# EAGLE design controller-HAT (EAGLE 9.2.2)
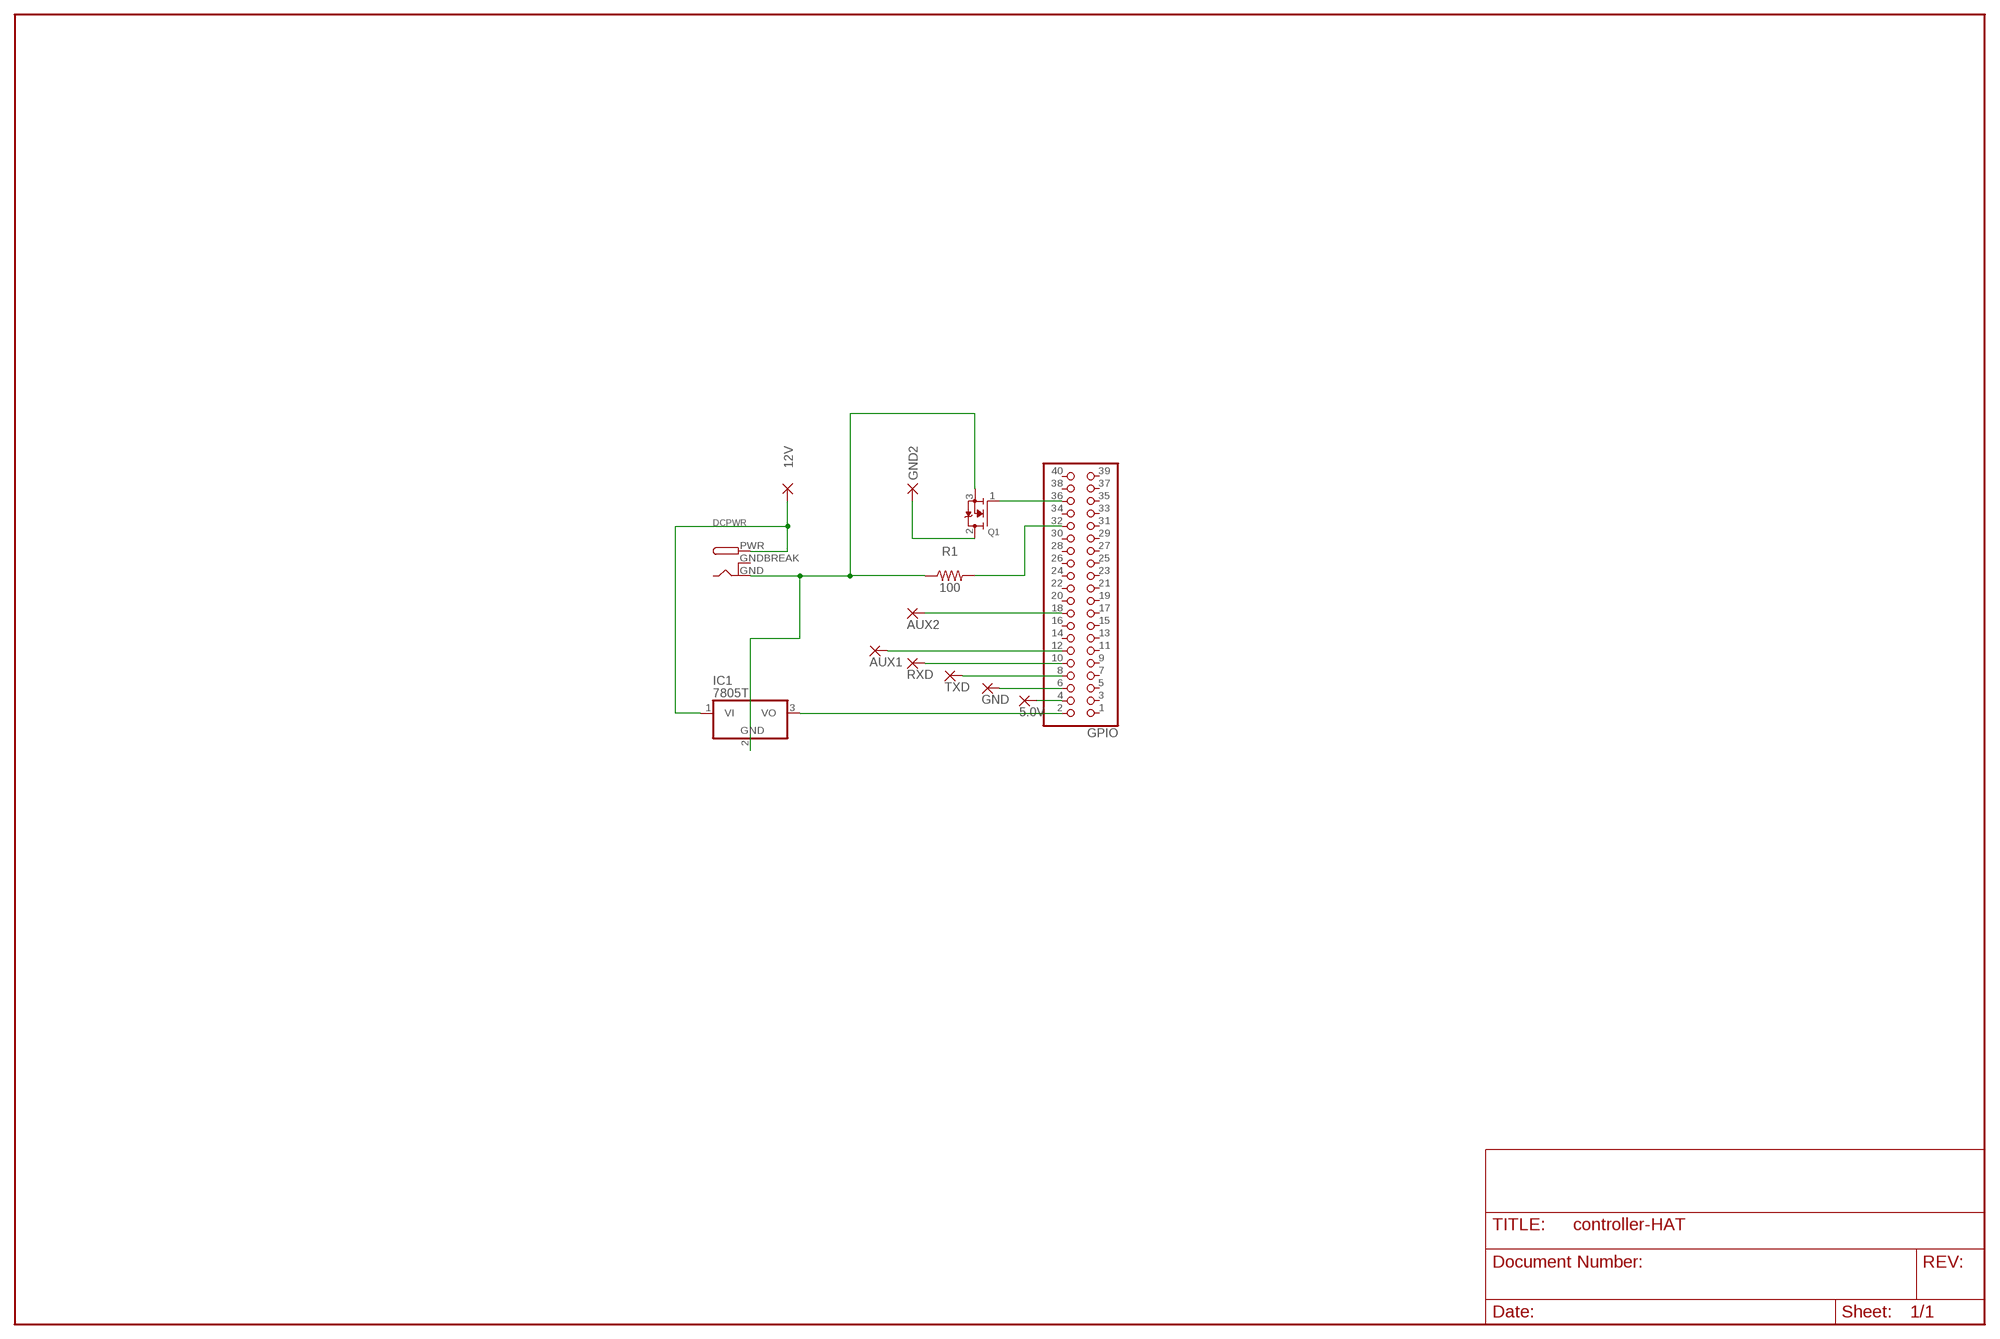
[diagram p0: schematic, sheet 1]

## Parts
5.0V  1,6/0,9  [1,6/0,9]
12V  1,6/0,9  [1,6/0,9]
AUX1  1,6/0,9  [1,6/0,9]
AUX2  1,6/0,9  [1,6/0,9]
DCPWR  DCBARRELPTH  [DCJACK_2MM_PTH]
GND  1,6/0,9  [1,6/0,9]
GND2  1,6/0,9  [1,6/0,9]
GPIO  PINHD-2X20  [2X20]
IC1  7805T  [TO220H]
Q1  MOSFET-NGDS_TO220V  [TO220V]
R1  100  100OHM-HORIZ-1/4W-1%  [AXIAL-0.3]
RXD  1,6/0,9  [1,6/0,9]
TXD  1,6/0,9  [1,6/0,9]

## Nets
N$1: GND2.1(P) Q1.2(D)
N$2: 12V.1(P) DCPWR.PWR IC1.1(VI)
N$3: GPIO.32 R1.P$2
N$4: DCPWR.GND IC1.2(GND) Q1.3(S) R1.P$1
N$5: GPIO.36 Q1.1(G)
N$6: 5.0V.1(P) GPIO.4
N$7: GND.1(P) GPIO.6
N$8: GPIO.8 TXD.1(P)
N$9: GPIO.10 RXD.1(P)
N$10: AUX1.1(P) GPIO.12
N$11: AUX2.1(P) GPIO.18
N$12: GPIO.2 IC1.3(VO)
Unconnected: GPIO.1 GPIO.3 GPIO.5 GPIO.7 GPIO.9 GPIO.11 GPIO.13 GPIO.14 GPIO.15 GPIO.16 GPIO.17 GPIO.19 GPIO.20 GPIO.21 GPIO.22 GPIO.23 GPIO.24 GPIO.25 GPIO.26 GPIO.27 GPIO.28 GPIO.29 GPIO.30 GPIO.31 GPIO.33 GPIO.34 GPIO.35 GPIO.37 GPIO.38 GPIO.39 GPIO.40

## Power pins joined to a net without a drawn wire
GNDBREAK: DCPWR.GNDBREAK

## Library data of the parts
5.0V = wirepad:1,6/0,9: THROUGH-HOLE PAD; SPICEPREFIX: X
12V AUX1 AUX2 GND GND2 RXD TXD = wirepad:1,6/0,9: THROUGH-HOLE PAD
DCPWR = adafruit:DCBARREL: 2.0mm DC Barrel Jack DCJACK_2MM_PTH - Through Hole Jack (4UConnector: 05537)
GPIO = adafruit:PINHD-2X20: PIN HEADER
IC1 = adafruit:78*: Positive VOLTAGE REGULATOR Added bigger pads to the TO-92 package
Q1 = adafruit:MOSFET-N: N-Channel Mosfet 2N7002E - 60V 260mA SOT23 [Digikey: 2N7002ET1GOSTR-ND] - REEL BSH103 - 30V 850mA SOT23 [Digikey: 568-5013-1-ND]
R1 = SparkFun-Resistors:100OHM: 100Ω resistor A resistor is a passive two-terminal electrical component that implements electrical resistance as a circuit element. Resistors act to reduce current flow, and, at the same time, act to lower voltage levels within circuits. - Wikipedia; PROD_ID: RES-12181

## Board
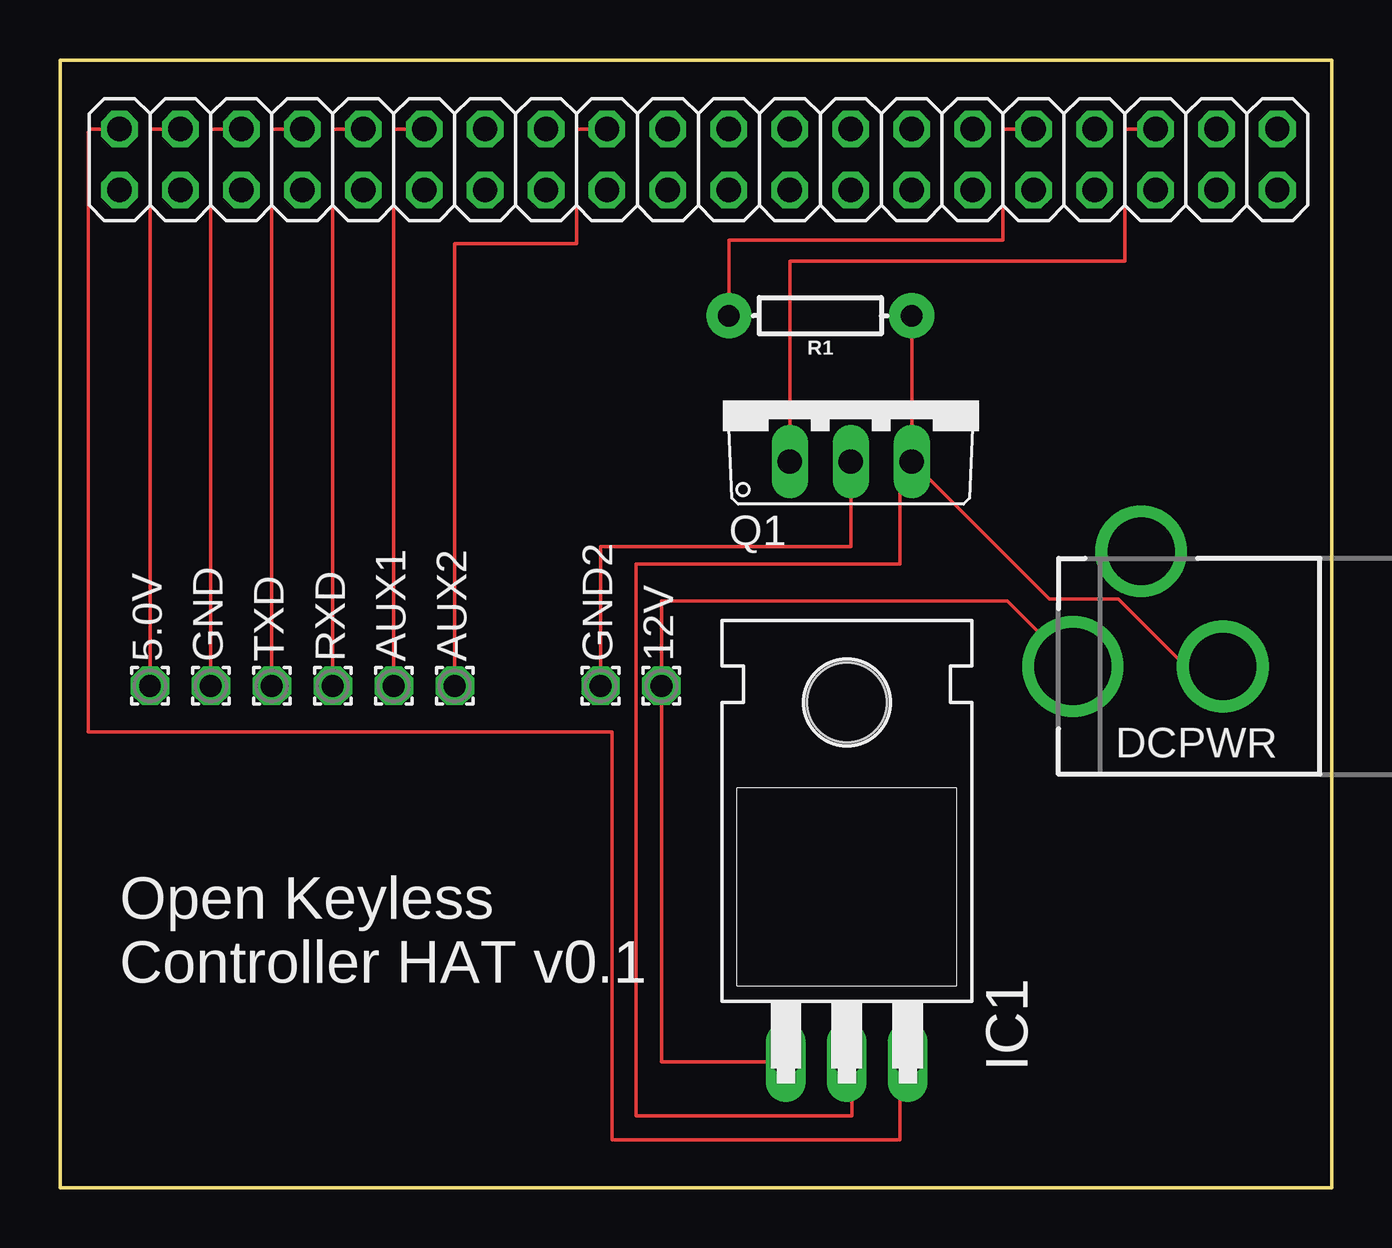
[diagram p1: board, top side]
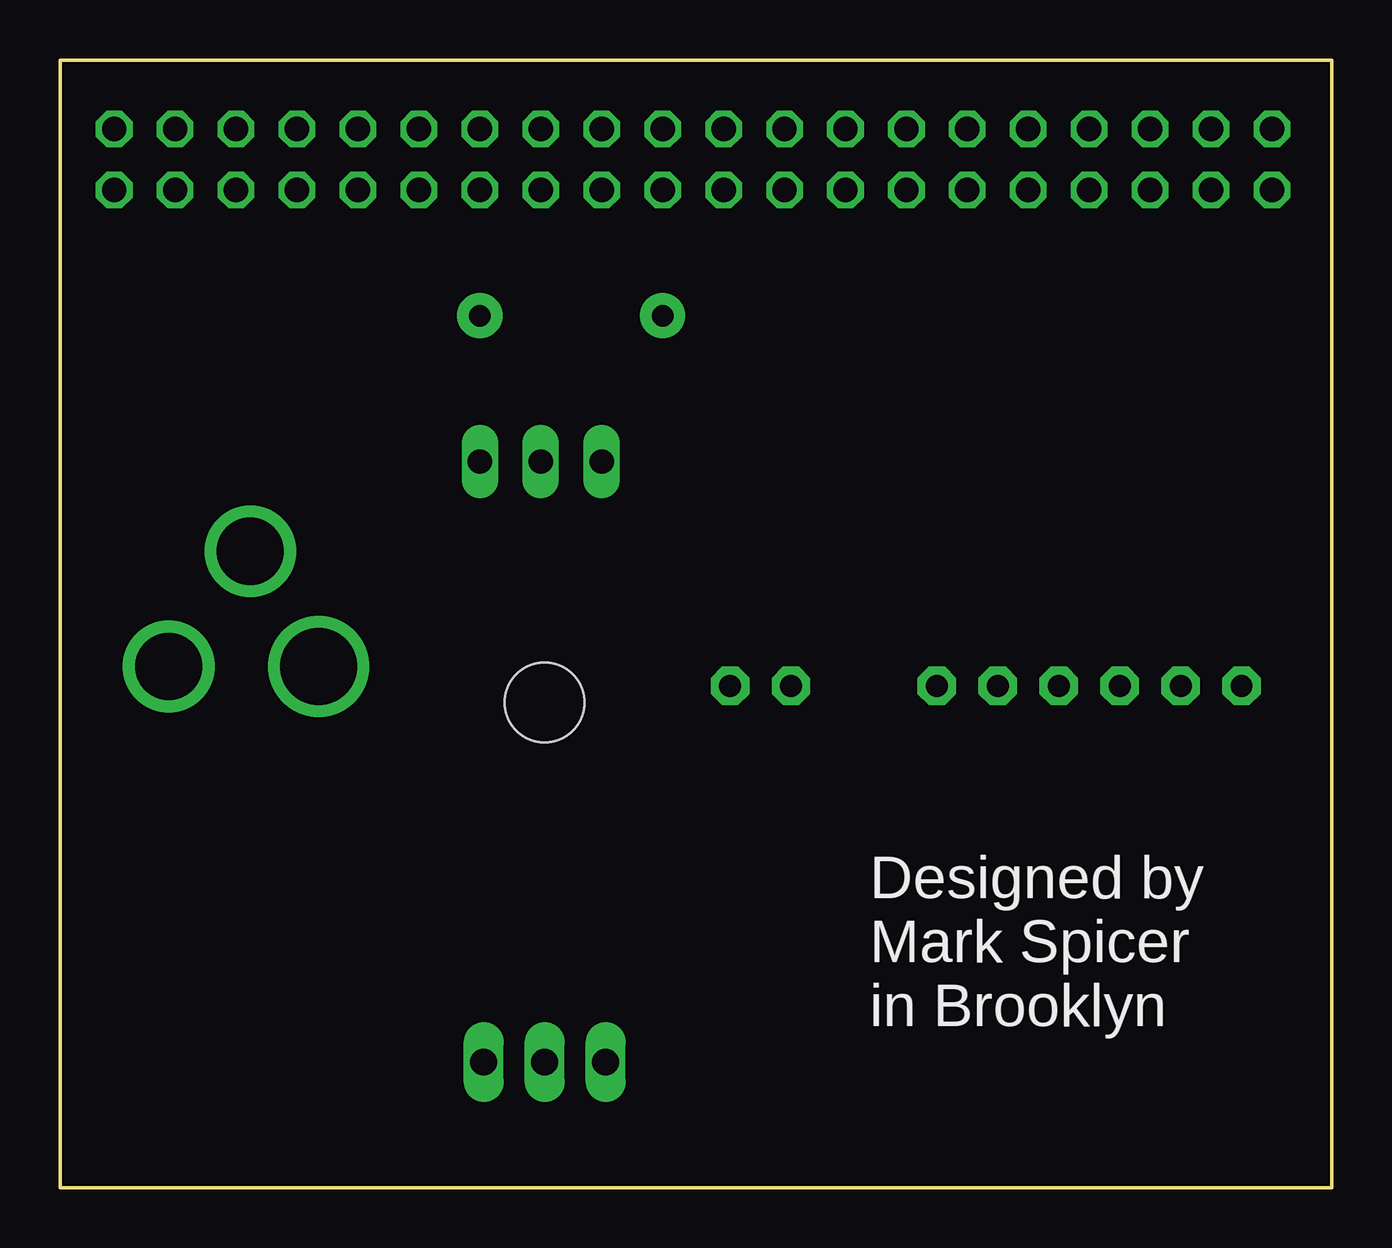
[diagram p2: board, bottom side, seen from below]

Size 53 x 47 mm. Coordinates in mm from the lower left corner, seen from the top.
Outline: 0,47 0,0 53,0 53,47 0,47
Copper layers (1*16): Top 0.035mm / dielectric 1.5mm / Bottom 0.035mm
Design rules "default": minimum track width 6mil, minimum drill 0.35mm, track to track 6mil, track to pad 6mil, pad to pad 6mil, via to via 6mil, smd to smd 6mil, copper to edge 40mil, drill to drill 6mil, minimum pad ring 10mil, minimum via ring 8mil, stop-mask expansion 4mil, vias tented up to drill 0mil, thermal gap 10mil

### Footprints (pad centres in the part's own frame; a part is rotated, then mirrored left to right if it is on the bottom)
1,6/0,9 = drill 0.914 pad 1.6 octagon: 1 0,0
DCJACK_2MM_PTH = drill 2.8: GND 0,7.35; GNDBREAK 4.8,10.75 | drill 3.2: PWR 0,13.6
2X20 = drill 1.016 octagon: 1 -24.13,-1.27; 2 -24.13,1.27; 3 -21.59,-1.27; 4 -21.59,1.27; 5 -19.05,-1.27; 6 -19.05,1.27; 7 -16.51,-1.27; 8 -16.51,1.27; 9 -13.97,-1.27; 10 -13.97,1.27; 11 -11.43,-1.27; 12 -11.43,1.27; 13 -8.89,-1.27; 14 -8.89,1.27; 15 -6.35,-1.27; 16 -6.35,1.27; 17 -3.81,-1.27; 18 -3.81,1.27; 19 -1.27,-1.27; 20 -1.27,1.27; 21 1.27,-1.27; 22 1.27,1.27; 23 3.81,-1.27; 24 3.81,1.27; 25 6.35,-1.27; 26 6.35,1.27; 27 8.89,-1.27; 28 8.89,1.27; 29 11.43,-1.27; 30 11.43,1.27; 31 13.97,-1.27; 32 13.97,1.27; 33 16.51,-1.27; 34 16.51,1.27; 35 19.05,-1.27; 36 19.05,1.27; 37 21.59,-1.27; 38 21.59,1.27; 39 24.13,-1.27; 40 24.13,1.27
TO220H = drill 1.118 long: 1 -2.54,-10.16; 2 0,-10.16; 3 2.54,-10.16 | hole 3.302: 0,4.826
TO220V = drill 1.016 long: 1 -2.54,-2.54; 2 0,-2.54; 3 2.54,-2.54
AXIAL-0.3 = drill 0.9 pad 1.88: P$1 -3.81,0; P$2 3.81,0

### Placement (x,y rotation side)
5.0V  3.75,20.91 0 top
12V  25.07,20.91 0 top
AUX1  13.91,20.91 0 top
AUX2  16.45,20.91 0 top
DCPWR  55.82,21.72 90 top
GND  6.29,20.91 0 top
GND2  22.53,20.91 0 top
GPIO  26.61,42.85 0 top
IC1  32.8,15.39 0 top
Q1  32.96,32.8 0 top
R1  31.69,36.34 180 top
RXD  11.37,20.91 0 top
TXD  8.83,20.91 0 top

### Tracks (layer width: path | path; a pad name or v marks a point on that pad's centre or on a via)
N$1
  Top 0.152: GND2.1 22.53,26.72 32.96,26.72 Q1.2
N$2
  Top 0.152: DCPWR.PWR 39.49,24.45 25.07,24.45 12V.1 25.07,5.23 IC1.1
N$3
  Top 0.152: R1.P$2 27.88,39.5 39.31,39.5 39.31,44.12 GPIO.32
N$4
  Top 0.152: Q1.3 41.23,24.53 44.12,24.53 46.93,21.72 DCPWR.GND | Q1.3 R1.P$1 | Q1.3 35,29.76 35,26 24,26 24,3 33,3 33,5.03 IC1.2
N$5
  Top 0.152: Q1.1 30.42,38.61 44.39,38.61 44.39,44.12 GPIO.36
N$6
  Top 0.152: 5.0V.1 3.75,44.12 GPIO.4
N$7
  Top 0.152: GND.1 6.29,44.12 GPIO.6
N$8
  Top 0.152: TXD.1 8.83,44.12 GPIO.8
N$9
  Top 0.152: RXD.1 11.37,44.12 GPIO.10
N$10
  Top 0.152: AUX1.1 13.91,44.12 GPIO.12
N$11
  Top 0.152: AUX2.1 16.45,39.34 21.53,39.34 21.53,44.12 GPIO.18
N$12
  Top 0.152: GPIO.2 1.29,44.12 1.17,44 1.17,19 23,19 23,2 35,2 35,4.89 IC1.3

### Text on the board
tPlace: Open Keyless / Controller HAT v0.1
bPlace: Designed by / Mark Spicer / in Brooklyn